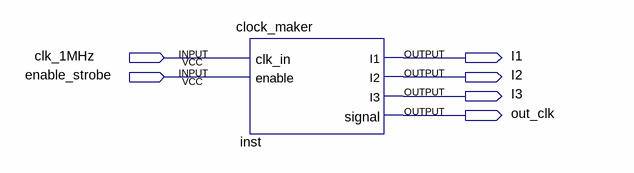
[diagram p0: schematic sheet]
// Quartus schematic CCD4210.bdf as structural Verilog: 1 symbols, 6 pins
module CCD4210 (
  input  clk_1MHz,
  input  enable_strobe,
  output I1,
  output I2,
  output I3,
  output out_clk
);

  clock_maker inst (.clk_in(clk_1MHz), .enable(enable_strobe), .I1(I1), .I2(I2), .I3(I3), .signal(out_clk));
endmodule
